# Altium schematic sheet led_2835_driver_circle_34X34cm.SchDoc
size A3; SheetNumber: 1; SheetTotal: 1
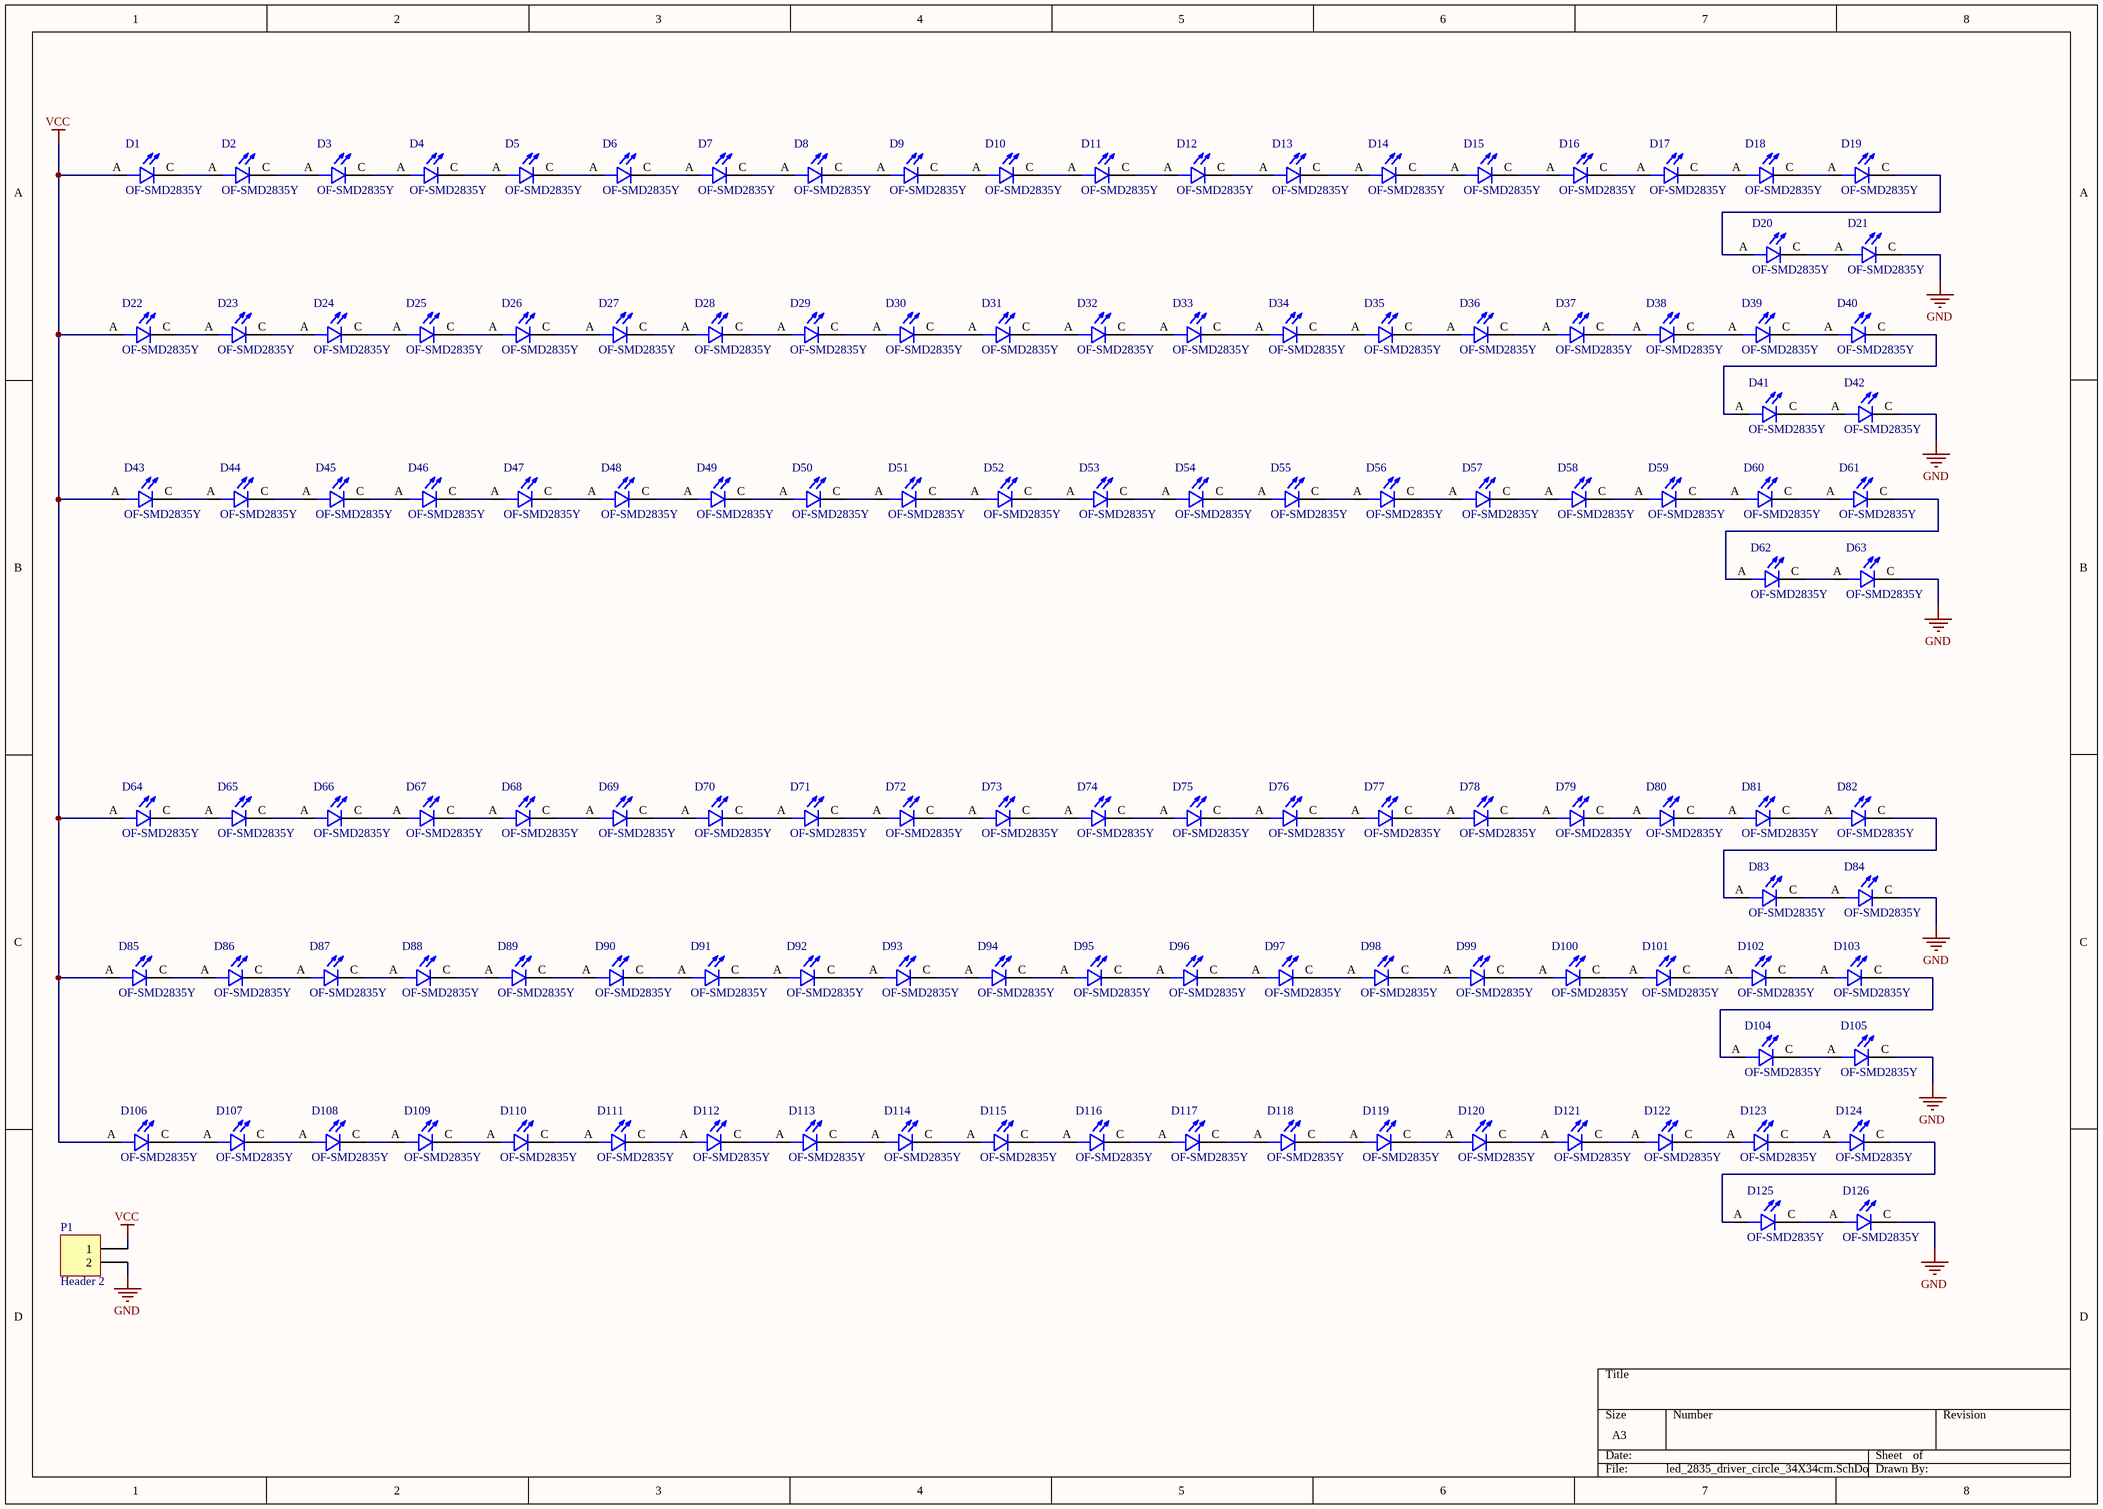
[diagram p0: led_2835_driver_circle_34X34cm.SchDoc]

## Parts
D1  OF-SMD2835Y  [LED_OF-SMD2835Y]
D2  OF-SMD2835Y  [LED_OF-SMD2835Y]
D3  OF-SMD2835Y  [LED_OF-SMD2835Y]
D4  OF-SMD2835Y  [LED_OF-SMD2835Y]
D5  OF-SMD2835Y  [LED_OF-SMD2835Y]
D6  OF-SMD2835Y  [LED_OF-SMD2835Y]
D7  OF-SMD2835Y  [LED_OF-SMD2835Y]
D8  OF-SMD2835Y  [LED_OF-SMD2835Y]
D9  OF-SMD2835Y  [LED_OF-SMD2835Y]
D10  OF-SMD2835Y  [LED_OF-SMD2835Y]
D11  OF-SMD2835Y  [LED_OF-SMD2835Y]
D12  OF-SMD2835Y  [LED_OF-SMD2835Y]
D13  OF-SMD2835Y  [LED_OF-SMD2835Y]
D14  OF-SMD2835Y  [LED_OF-SMD2835Y]
D15  OF-SMD2835Y  [LED_OF-SMD2835Y]
D16  OF-SMD2835Y  [LED_OF-SMD2835Y]
D17  OF-SMD2835Y  [LED_OF-SMD2835Y]
D18  OF-SMD2835Y  [LED_OF-SMD2835Y]
D19  OF-SMD2835Y  [LED_OF-SMD2835Y]
D20  OF-SMD2835Y  [LED_OF-SMD2835Y]
D21  OF-SMD2835Y  [LED_OF-SMD2835Y]
D22  OF-SMD2835Y  [LED_OF-SMD2835Y]
D23  OF-SMD2835Y  [LED_OF-SMD2835Y]
D24  OF-SMD2835Y  [LED_OF-SMD2835Y]
D25  OF-SMD2835Y  [LED_OF-SMD2835Y]
D26  OF-SMD2835Y  [LED_OF-SMD2835Y]
D27  OF-SMD2835Y  [LED_OF-SMD2835Y]
D28  OF-SMD2835Y  [LED_OF-SMD2835Y]
D29  OF-SMD2835Y  [LED_OF-SMD2835Y]
D30  OF-SMD2835Y  [LED_OF-SMD2835Y]
D31  OF-SMD2835Y  [LED_OF-SMD2835Y]
D32  OF-SMD2835Y  [LED_OF-SMD2835Y]
D33  OF-SMD2835Y  [LED_OF-SMD2835Y]
D34  OF-SMD2835Y  [LED_OF-SMD2835Y]
D35  OF-SMD2835Y  [LED_OF-SMD2835Y]
D36  OF-SMD2835Y  [LED_OF-SMD2835Y]
D37  OF-SMD2835Y  [LED_OF-SMD2835Y]
D38  OF-SMD2835Y  [LED_OF-SMD2835Y]
D39  OF-SMD2835Y  [LED_OF-SMD2835Y]
D40  OF-SMD2835Y  [LED_OF-SMD2835Y]
D41  OF-SMD2835Y  [LED_OF-SMD2835Y]
D42  OF-SMD2835Y  [LED_OF-SMD2835Y]
D43  OF-SMD2835Y  [LED_OF-SMD2835Y]
D44  OF-SMD2835Y  [LED_OF-SMD2835Y]
D45  OF-SMD2835Y  [LED_OF-SMD2835Y]
D46  OF-SMD2835Y  [LED_OF-SMD2835Y]
D47  OF-SMD2835Y  [LED_OF-SMD2835Y]
D48  OF-SMD2835Y  [LED_OF-SMD2835Y]
D49  OF-SMD2835Y  [LED_OF-SMD2835Y]
D50  OF-SMD2835Y  [LED_OF-SMD2835Y]
D51  OF-SMD2835Y  [LED_OF-SMD2835Y]
D52  OF-SMD2835Y  [LED_OF-SMD2835Y]
D53  OF-SMD2835Y  [LED_OF-SMD2835Y]
D54  OF-SMD2835Y  [LED_OF-SMD2835Y]
D55  OF-SMD2835Y  [LED_OF-SMD2835Y]
D56  OF-SMD2835Y  [LED_OF-SMD2835Y]
D57  OF-SMD2835Y  [LED_OF-SMD2835Y]
D58  OF-SMD2835Y  [LED_OF-SMD2835Y]
D59  OF-SMD2835Y  [LED_OF-SMD2835Y]
D60  OF-SMD2835Y  [LED_OF-SMD2835Y]
D61  OF-SMD2835Y  [LED_OF-SMD2835Y]
D62  OF-SMD2835Y  [LED_OF-SMD2835Y]
D63  OF-SMD2835Y  [LED_OF-SMD2835Y]
D64  OF-SMD2835Y  [LED_OF-SMD2835Y]
D65  OF-SMD2835Y  [LED_OF-SMD2835Y]
D66  OF-SMD2835Y  [LED_OF-SMD2835Y]
D67  OF-SMD2835Y  [LED_OF-SMD2835Y]
D68  OF-SMD2835Y  [LED_OF-SMD2835Y]
D69  OF-SMD2835Y  [LED_OF-SMD2835Y]
D70  OF-SMD2835Y  [LED_OF-SMD2835Y]
D71  OF-SMD2835Y  [LED_OF-SMD2835Y]
D72  OF-SMD2835Y  [LED_OF-SMD2835Y]
D73  OF-SMD2835Y  [LED_OF-SMD2835Y]
D74  OF-SMD2835Y  [LED_OF-SMD2835Y]
D75  OF-SMD2835Y  [LED_OF-SMD2835Y]
D76  OF-SMD2835Y  [LED_OF-SMD2835Y]
D77  OF-SMD2835Y  [LED_OF-SMD2835Y]
D78  OF-SMD2835Y  [LED_OF-SMD2835Y]
D79  OF-SMD2835Y  [LED_OF-SMD2835Y]
D80  OF-SMD2835Y  [LED_OF-SMD2835Y]
D81  OF-SMD2835Y  [LED_OF-SMD2835Y]
D82  OF-SMD2835Y  [LED_OF-SMD2835Y]
D83  OF-SMD2835Y  [LED_OF-SMD2835Y]
D84  OF-SMD2835Y  [LED_OF-SMD2835Y]
D85  OF-SMD2835Y  [LED_OF-SMD2835Y]
D86  OF-SMD2835Y  [LED_OF-SMD2835Y]
D87  OF-SMD2835Y  [LED_OF-SMD2835Y]
D88  OF-SMD2835Y  [LED_OF-SMD2835Y]
D89  OF-SMD2835Y  [LED_OF-SMD2835Y]
D90  OF-SMD2835Y  [LED_OF-SMD2835Y]
D91  OF-SMD2835Y  [LED_OF-SMD2835Y]
D92  OF-SMD2835Y  [LED_OF-SMD2835Y]
D93  OF-SMD2835Y  [LED_OF-SMD2835Y]
D94  OF-SMD2835Y  [LED_OF-SMD2835Y]
D95  OF-SMD2835Y  [LED_OF-SMD2835Y]
D96  OF-SMD2835Y  [LED_OF-SMD2835Y]
D97  OF-SMD2835Y  [LED_OF-SMD2835Y]
D98  OF-SMD2835Y  [LED_OF-SMD2835Y]
D99  OF-SMD2835Y  [LED_OF-SMD2835Y]
D100  OF-SMD2835Y  [LED_OF-SMD2835Y]
D101  OF-SMD2835Y  [LED_OF-SMD2835Y]
D102  OF-SMD2835Y  [LED_OF-SMD2835Y]
D103  OF-SMD2835Y  [LED_OF-SMD2835Y]
D104  OF-SMD2835Y  [LED_OF-SMD2835Y]
D105  OF-SMD2835Y  [LED_OF-SMD2835Y]
D106  OF-SMD2835Y  [LED_OF-SMD2835Y]
D107  OF-SMD2835Y  [LED_OF-SMD2835Y]
D108  OF-SMD2835Y  [LED_OF-SMD2835Y]
D109  OF-SMD2835Y  [LED_OF-SMD2835Y]
D110  OF-SMD2835Y  [LED_OF-SMD2835Y]
D111  OF-SMD2835Y  [LED_OF-SMD2835Y]
D112  OF-SMD2835Y  [LED_OF-SMD2835Y]
D113  OF-SMD2835Y  [LED_OF-SMD2835Y]
D114  OF-SMD2835Y  [LED_OF-SMD2835Y]
D115  OF-SMD2835Y  [LED_OF-SMD2835Y]
D116  OF-SMD2835Y  [LED_OF-SMD2835Y]
D117  OF-SMD2835Y  [LED_OF-SMD2835Y]
D118  OF-SMD2835Y  [LED_OF-SMD2835Y]
D119  OF-SMD2835Y  [LED_OF-SMD2835Y]
D120  OF-SMD2835Y  [LED_OF-SMD2835Y]
D121  OF-SMD2835Y  [LED_OF-SMD2835Y]
D122  OF-SMD2835Y  [LED_OF-SMD2835Y]
D123  OF-SMD2835Y  [LED_OF-SMD2835Y]
D124  OF-SMD2835Y  [LED_OF-SMD2835Y]
D125  OF-SMD2835Y  [LED_OF-SMD2835Y]
D126  OF-SMD2835Y  [LED_OF-SMD2835Y]
P1  Header 2  [HDR1X2_SMD]

## Nets
GND: D21.C D42.C D63.C D84.C D105.C D126.C P1.GND(2)
VCC: D1.A D22.A D43.A D64.A D85.A D106.A P1.VCC(1)
NetD1_C: D1.C D2.A
NetD2_C: D2.C D3.A
NetD3_C: D3.C D4.A
NetD4_C: D4.C D5.A
NetD5_C: D5.C D6.A
NetD6_C: D6.C D7.A
NetD7_C: D7.C D8.A
NetD8_C: D8.C D9.A
NetD9_C: D9.C D10.A
NetD10_C: D10.C D11.A
NetD11_C: D11.C D12.A
NetD12_C: D12.C D13.A
NetD13_C: D13.C D14.A
NetD14_C: D14.C D15.A
NetD15_C: D15.C D16.A
NetD16_C: D16.C D17.A
NetD17_C: D17.C D18.A
NetD18_C: D18.C D19.A
NetD19_C: D19.C D20.A
NetD20_C: D20.C D21.A
NetD22_C: D22.C D23.A
NetD23_C: D23.C D24.A
NetD24_C: D24.C D25.A
NetD25_C: D25.C D26.A
NetD26_C: D26.C D27.A
NetD27_C: D27.C D28.A
NetD28_C: D28.C D29.A
NetD29_C: D29.C D30.A
NetD30_C: D30.C D31.A
NetD31_C: D31.C D32.A
NetD32_C: D32.C D33.A
NetD33_C: D33.C D34.A
NetD34_C: D34.C D35.A
NetD35_C: D35.C D36.A
NetD36_C: D36.C D37.A
NetD37_C: D37.C D38.A
NetD38_C: D38.C D39.A
NetD39_C: D39.C D40.A
NetD40_C: D40.C D41.A
NetD41_C: D41.C D42.A
NetD43_C: D43.C D44.A
NetD44_C: D44.C D45.A
NetD45_C: D45.C D46.A
NetD46_C: D46.C D47.A
NetD47_C: D47.C D48.A
NetD48_C: D48.C D49.A
NetD49_C: D49.C D50.A
NetD50_C: D50.C D51.A
NetD51_C: D51.C D52.A
NetD52_C: D52.C D53.A
NetD53_C: D53.C D54.A
NetD54_C: D54.C D55.A
NetD55_C: D55.C D56.A
NetD56_C: D56.C D57.A
NetD57_C: D57.C D58.A
NetD58_C: D58.C D59.A
NetD59_C: D59.C D60.A
NetD60_C: D60.C D61.A
NetD61_C: D61.C D62.A
NetD62_C: D62.C D63.A
NetD64_C: D64.C D65.A
NetD65_C: D65.C D66.A
NetD66_C: D66.C D67.A
NetD67_C: D67.C D68.A
NetD68_C: D68.C D69.A
NetD69_C: D69.C D70.A
NetD70_C: D70.C D71.A
NetD71_C: D71.C D72.A
NetD72_C: D72.C D73.A
NetD73_C: D73.C D74.A
NetD74_C: D74.C D75.A
NetD75_C: D75.C D76.A
NetD76_C: D76.C D77.A
NetD77_C: D77.C D78.A
NetD78_C: D78.C D79.A
NetD79_C: D79.C D80.A
NetD80_C: D80.C D81.A
NetD81_C: D81.C D82.A
NetD82_C: D82.C D83.A
NetD83_C: D83.C D84.A
NetD85_C: D85.C D86.A
NetD86_C: D86.C D87.A
NetD87_C: D87.C D88.A
NetD88_C: D88.C D89.A
NetD89_C: D89.C D90.A
NetD90_C: D90.C D91.A
NetD91_C: D91.C D92.A
NetD92_C: D92.C D93.A
NetD93_C: D93.C D94.A
NetD94_C: D94.C D95.A
NetD95_C: D95.C D96.A
NetD96_C: D96.C D97.A
NetD97_C: D97.C D98.A
NetD98_C: D98.C D99.A
NetD99_C: D99.C D100.A
NetD100_C: D100.C D101.A
NetD101_C: D101.C D102.A
NetD102_C: D102.C D103.A
NetD103_C: D103.C D104.A
NetD104_C: D104.C D105.A
NetD106_C: D106.C D107.A
NetD107_C: D107.C D108.A
NetD108_C: D108.C D109.A
NetD109_C: D109.C D110.A
NetD110_C: D110.C D111.A
NetD111_C: D111.C D112.A
NetD112_C: D112.C D113.A
NetD113_C: D113.C D114.A
NetD114_C: D114.C D115.A
NetD115_C: D115.C D116.A
NetD116_C: D116.C D117.A
NetD117_C: D117.C D118.A
NetD118_C: D118.C D119.A
NetD119_C: D119.C D120.A
NetD120_C: D120.C D121.A
NetD121_C: D121.C D122.A
NetD122_C: D122.C D123.A
NetD123_C: D123.C D124.A
NetD124_C: D124.C D125.A
NetD125_C: D125.C D126.A

## Library data of the parts
D1-D126 = OF-SMD2835Y: LED; SMD; 2835, PLCC2; yellow; 2200-2800mcd; 2.8x3.5x0.75mm; 120Â°; Availability: Unavailable; MP: OF-SMD2835Y; Value: *; Package: None; Price: None
P1 = Header 2: Header, 2-Pin; LatestRevisionDate: 17-Jul-2002; LatestRevisionNote: Re-released for DXP Platform.; Publisher: Altium Limited